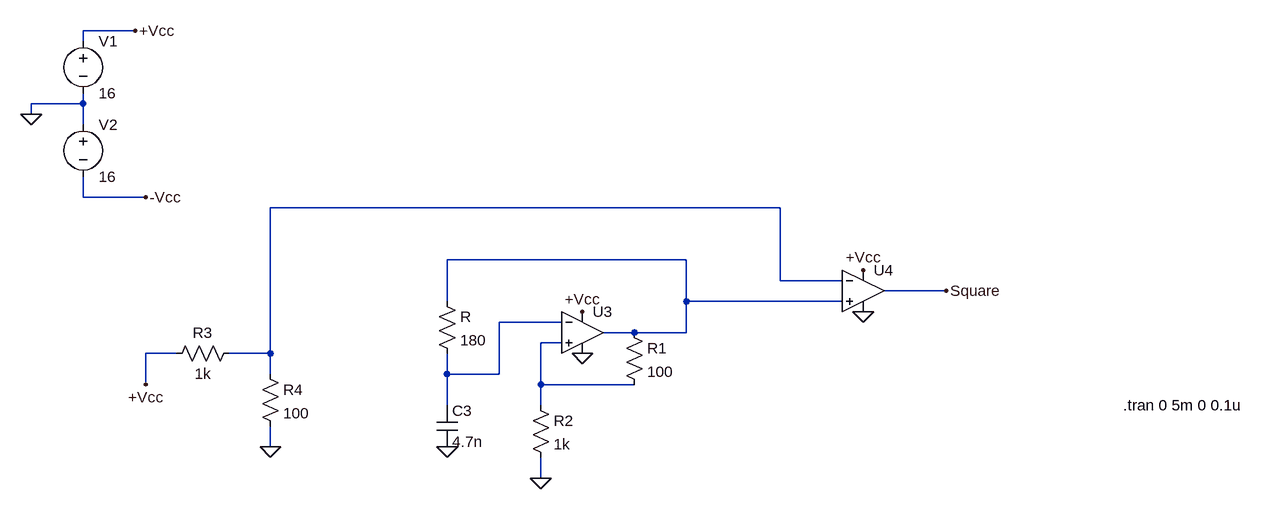
[diagram p0: schematic Osclidor_2 (1).asc]
Osclidor_2 (1).asc, the LTspice schematic file:
Version 4
SHEET 1 2708 1040
WIRE -1664 16 -1744 16
WIRE -1744 32 -1744 16
WIRE -1744 128 -1744 112
WIRE -1744 128 -1824 128
WIRE -1824 144 -1824 128
WIRE -1744 160 -1744 128
WIRE -1744 272 -1744 240
WIRE -1648 272 -1744 272
WIRE -672 288 -1456 288
WIRE -816 368 -1184 368
WIRE -672 400 -672 288
WIRE -576 400 -672 400
WIRE -416 416 -512 416
WIRE -1184 432 -1184 368
WIRE -816 432 -816 368
WIRE -576 432 -816 432
WIRE -1008 464 -1104 464
WIRE -896 480 -944 480
WIRE -816 480 -816 432
WIRE -816 480 -896 480
WIRE -1008 496 -1040 496
WIRE -1600 512 -1648 512
WIRE -1456 512 -1456 288
WIRE -1456 512 -1520 512
WIRE -1456 544 -1456 512
WIRE -1184 544 -1184 512
WIRE -1104 544 -1104 464
WIRE -1104 544 -1184 544
WIRE -1648 560 -1648 512
WIRE -1040 560 -1040 496
WIRE -896 560 -1040 560
WIRE -1184 592 -1184 544
WIRE -1040 592 -1040 560
WIRE -1456 656 -1456 624
WIRE -1040 704 -1040 672
FLAG -976 448 +Vcc
FLAG -1184 656 0
FLAG -1040 704 0
FLAG -1456 656 0
FLAG -1648 560 +Vcc
FLAG -976 512 0
FLAG -544 384 +Vcc
FLAG -544 448 0
FLAG -1824 144 0
FLAG -1664 16 +Vcc
FLAG -1648 272 -Vcc
FLAG -416 416 Square
SYMBOL OpAmps\\UniversalOpamp2 -976 480 R0
SYMATTR InstName U3
SYMATTR Value2 Avol=1Meg GBW=100Meg Slew=100Meg
SYMBOL res -1056 576 R0
SYMATTR InstName R2
SYMATTR Value 1k
SYMBOL res -1200 416 R0
SYMATTR InstName R
SYMATTR Value 180
SYMBOL cap -1200 592 R0
SYMATTR InstName C3
SYMATTR Value 4.7n
SYMBOL res -912 464 R0
SYMATTR InstName R1
SYMATTR Value 100
SYMBOL OpAmps\\UniversalOpamp2 -544 416 R0
SYMATTR InstName U4
SYMATTR Value2 Avol=1Meg GBW=100Meg Slew=100Meg
SYMBOL res -1504 496 R90
WINDOW 0 0 56 VBottom 2
WINDOW 3 32 56 VTop 2
SYMATTR InstName R3
SYMATTR Value 1k
SYMBOL res -1472 528 R0
SYMATTR InstName R4
SYMATTR Value 100
SYMBOL voltage -1744 16 R0
WINDOW 123 0 0 Left 0
WINDOW 39 0 0 Left 0
SYMATTR InstName V1
SYMATTR Value 16
SYMBOL voltage -1744 144 R0
WINDOW 123 0 0 Left 0
WINDOW 39 0 0 Left 0
SYMATTR InstName V2
SYMATTR Value 16
TEXT -144 592 Left 2 !.tran 0 5m 0 0.1u

The netlist it stands for:
* Osclidor_2 (1).asc
XU3 N004 N003 +Vcc 0 N002 level.2 Avol=1Meg GBW=100Meg Slew=100Meg ilimit=25m rail=0 Vos=0 phimargin=45 en=0 enk=0 in=0 ink=0 Rin=500Meg  ; pins IN+ IN- V+ V- OUT
R2 N004 0 1k
R N002 N003 180
C3 N003 0 4.7n
R1 N002 N004 100
XU4 N002 N001 +Vcc 0 Square level.2 Avol=1Meg GBW=100Meg Slew=100Meg ilimit=25m rail=0 Vos=0 phimargin=45 en=0 enk=0 in=0 ink=0 Rin=500Meg  ; pins IN+ IN- V+ V- OUT
R3 N001 +Vcc 1k
R4 N001 0 100
V1 +Vcc 0 16
V2 0 -Vcc 16
.tran 0 5m 0 0.1u
.lib UniversalOpamps2.sub
.backanno
.end